# EAGLE schematic Liftmaster78LM (EAGLE 7.2.0)
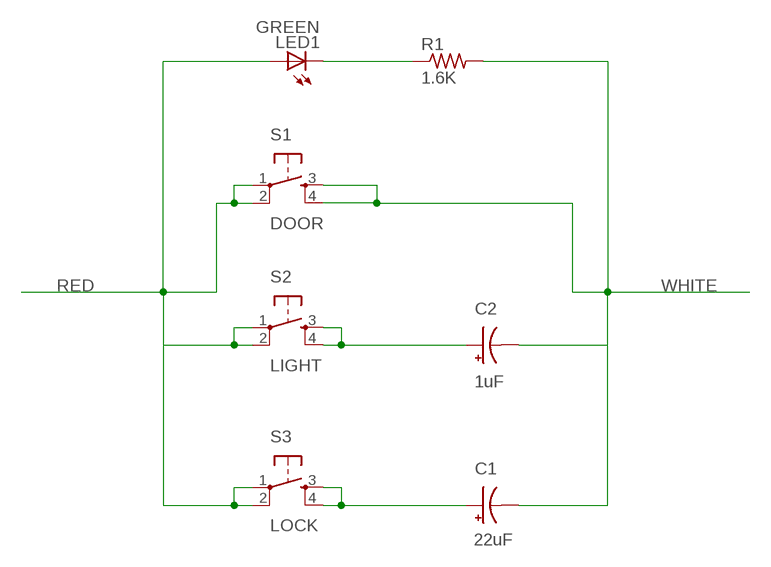
[diagram p0: schematic, sheet 1]

## Parts
C1  22uF  CPOL-USE2-5  [E2-5]
C2  1uF  CPOL-USE2-5  [E2-5]
LED1  GREEN  TLLG4400  [LED3MM]
R1  1.6K  R-US_0207/10  [0207/10]
S1  DOOR  TAC_SWITCHSMD  [TACTILE_SWITCH_SMD]
S2  LIGHT  TAC_SWITCHSMD  [TACTILE_SWITCH_SMD]
S3  LOCK  TAC_SWITCHSMD  [TACTILE_SWITCH_SMD]

## Nets
N$1: LED1.K(C) R1.1
N$4: C2.+ S2.3 S2.4
N$5: C1.+ S3.3 S3.4
RED: LED1.A S1.1 S1.2 S2.1 S2.2 S3.1 S3.2
WHITE: C1.- C2.- R1.2 S1.3 S1.4

## Library data of the parts
C1 C2 = rcl:CPOL-US: POLARIZED CAPACITOR, American symbol
LED1 = led:TLLG4400: Low Current (2mA) LED 3 mm Tinted Diffused Package color GREEN Source: Data sheet <http://www.farnell.com/datasheets/391098.pdf>; MF: VISHAY SEMICONDUCTOR; OC_FARNELL: 1612435
R1 = rcl:R-US_: RESISTOR, American symbol
S1-S3 = Spark:TAC_SWITCH: SMD Tactiile Switch